# EAGLE design v12 (EAGLE 7.2.0)
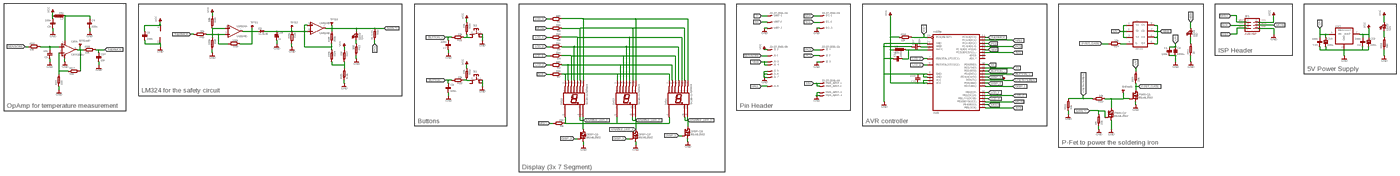
[diagram p0: schematic, sheet 1, overview]
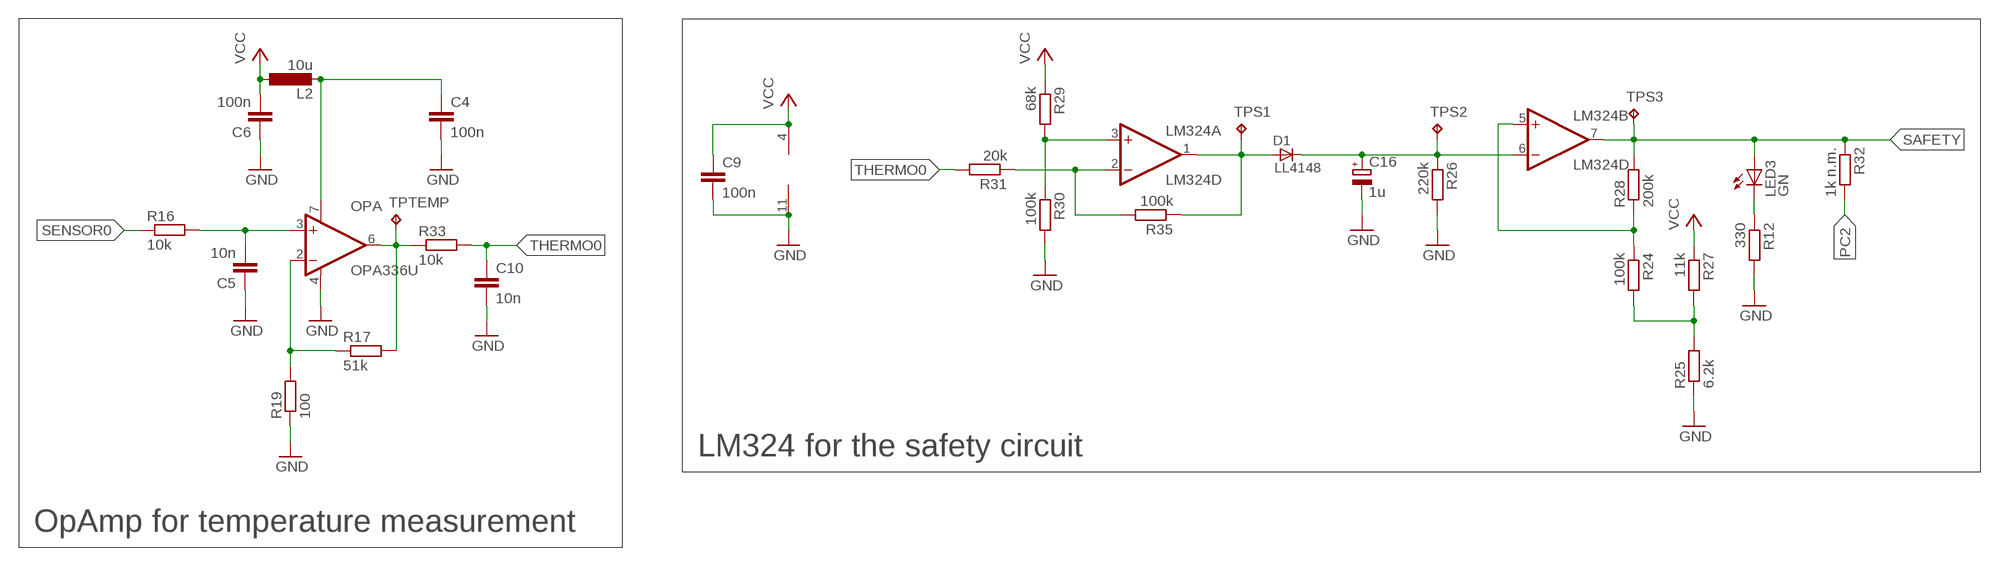
[diagram p1: schematic, sheet 1, part 1 of 4]
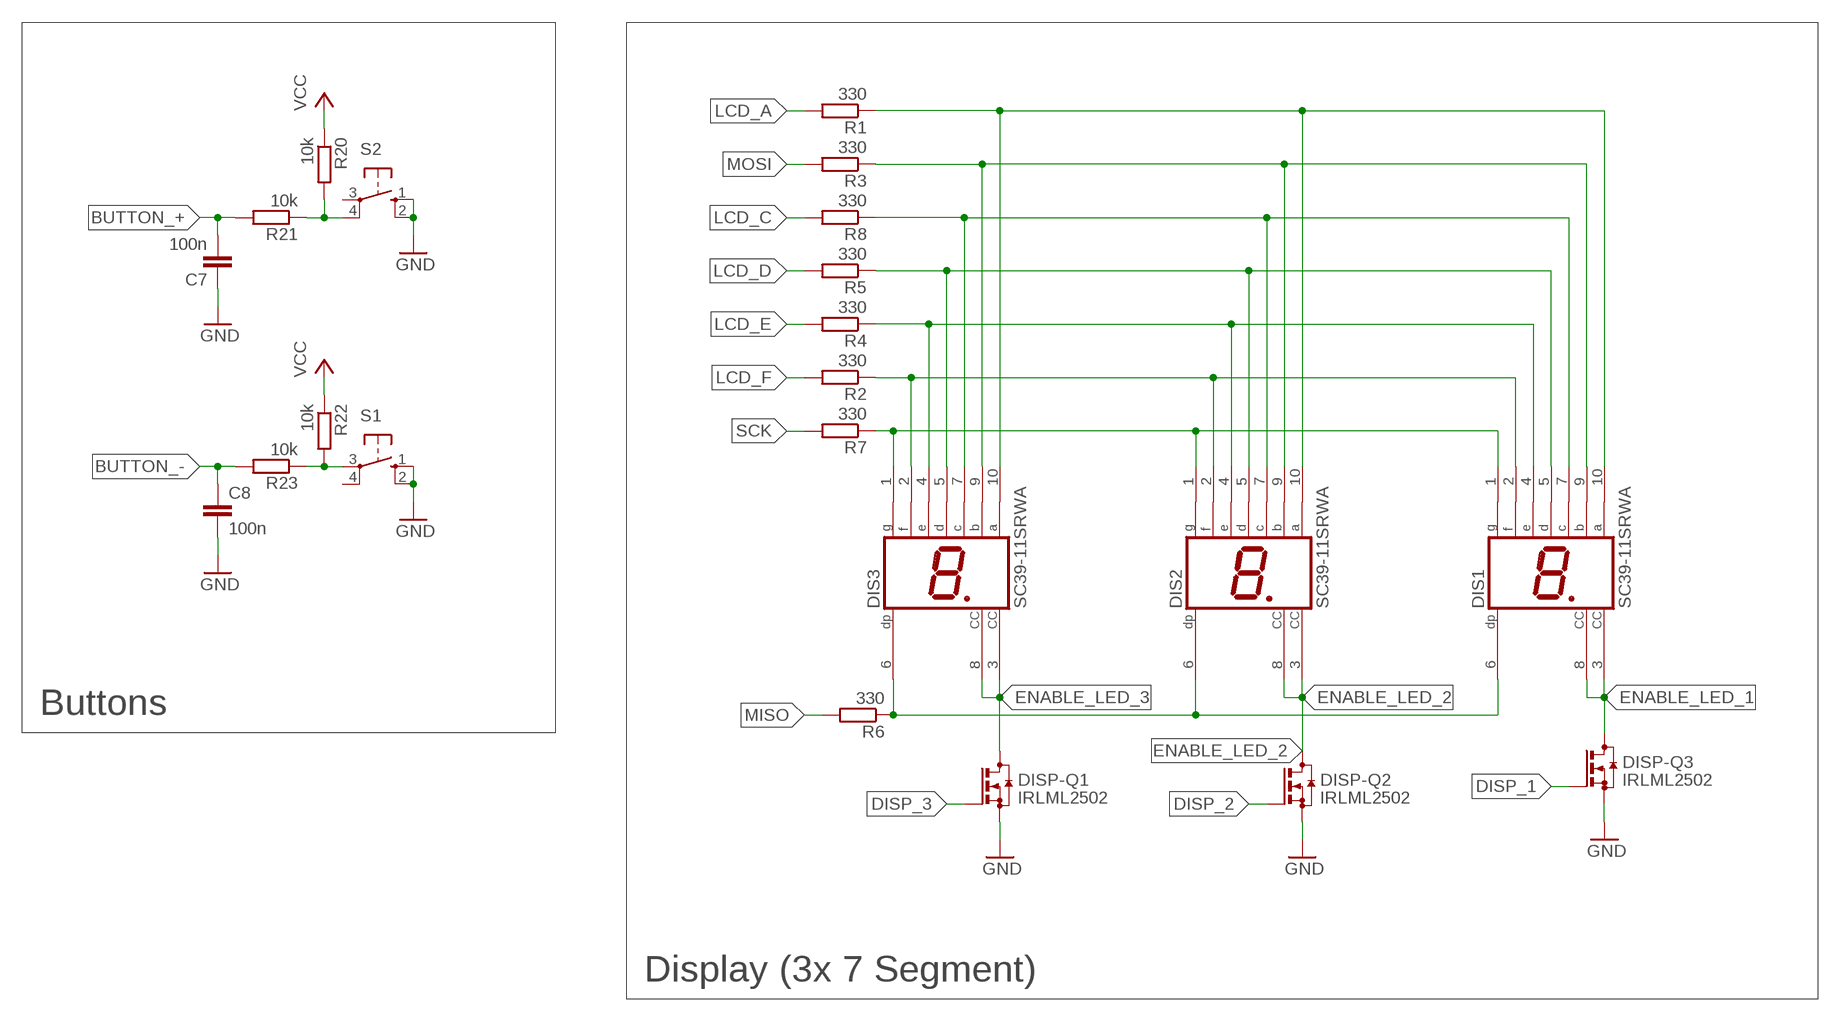
[diagram p2: schematic, sheet 1, part 2 of 4]
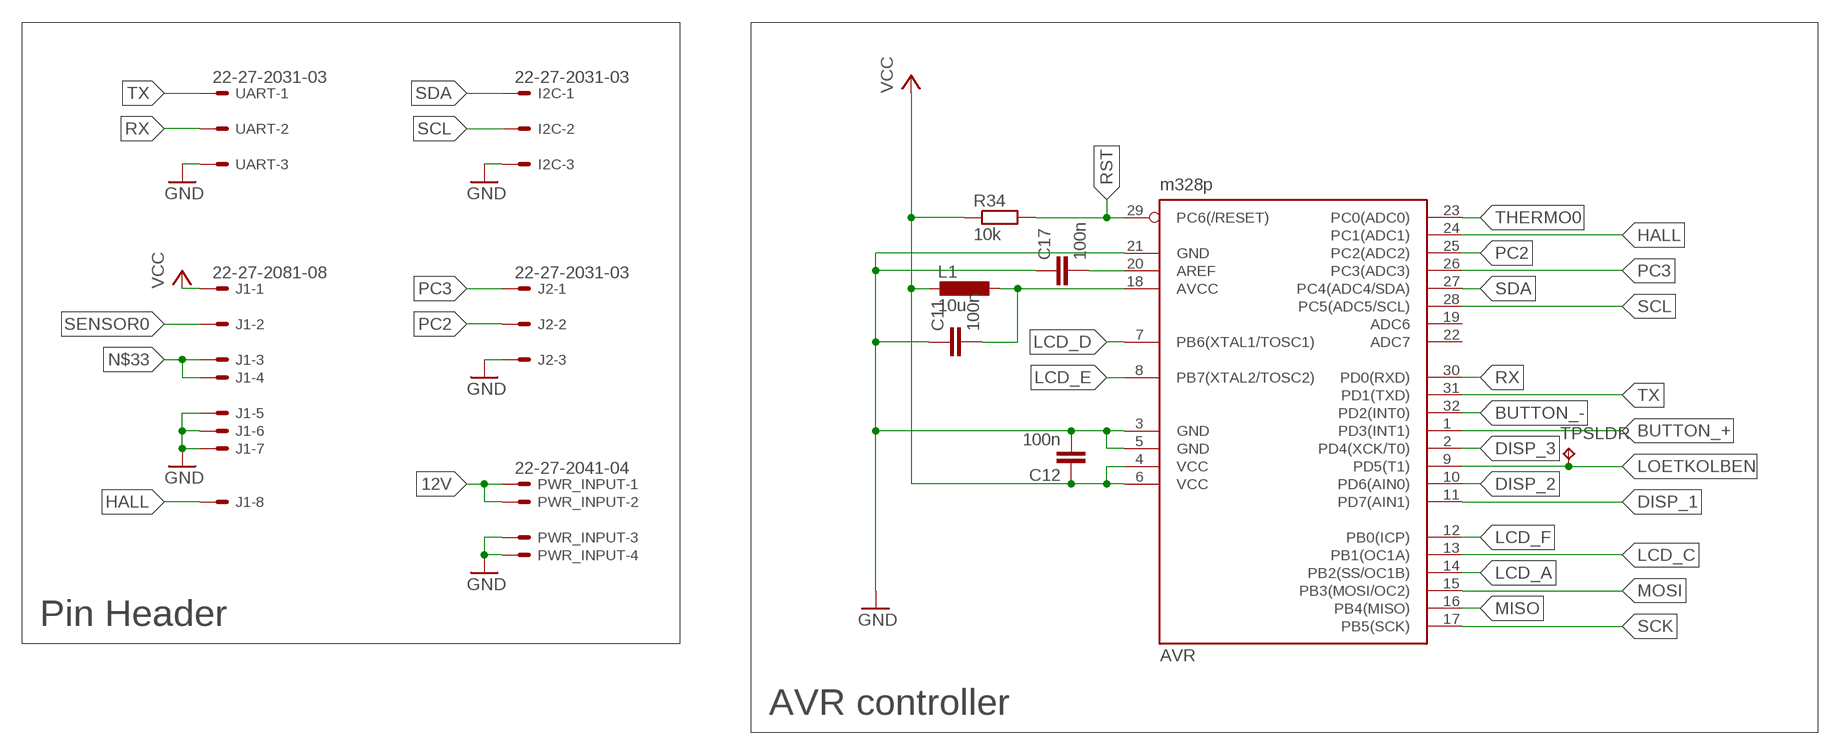
[diagram p3: schematic, sheet 1, part 3 of 4]
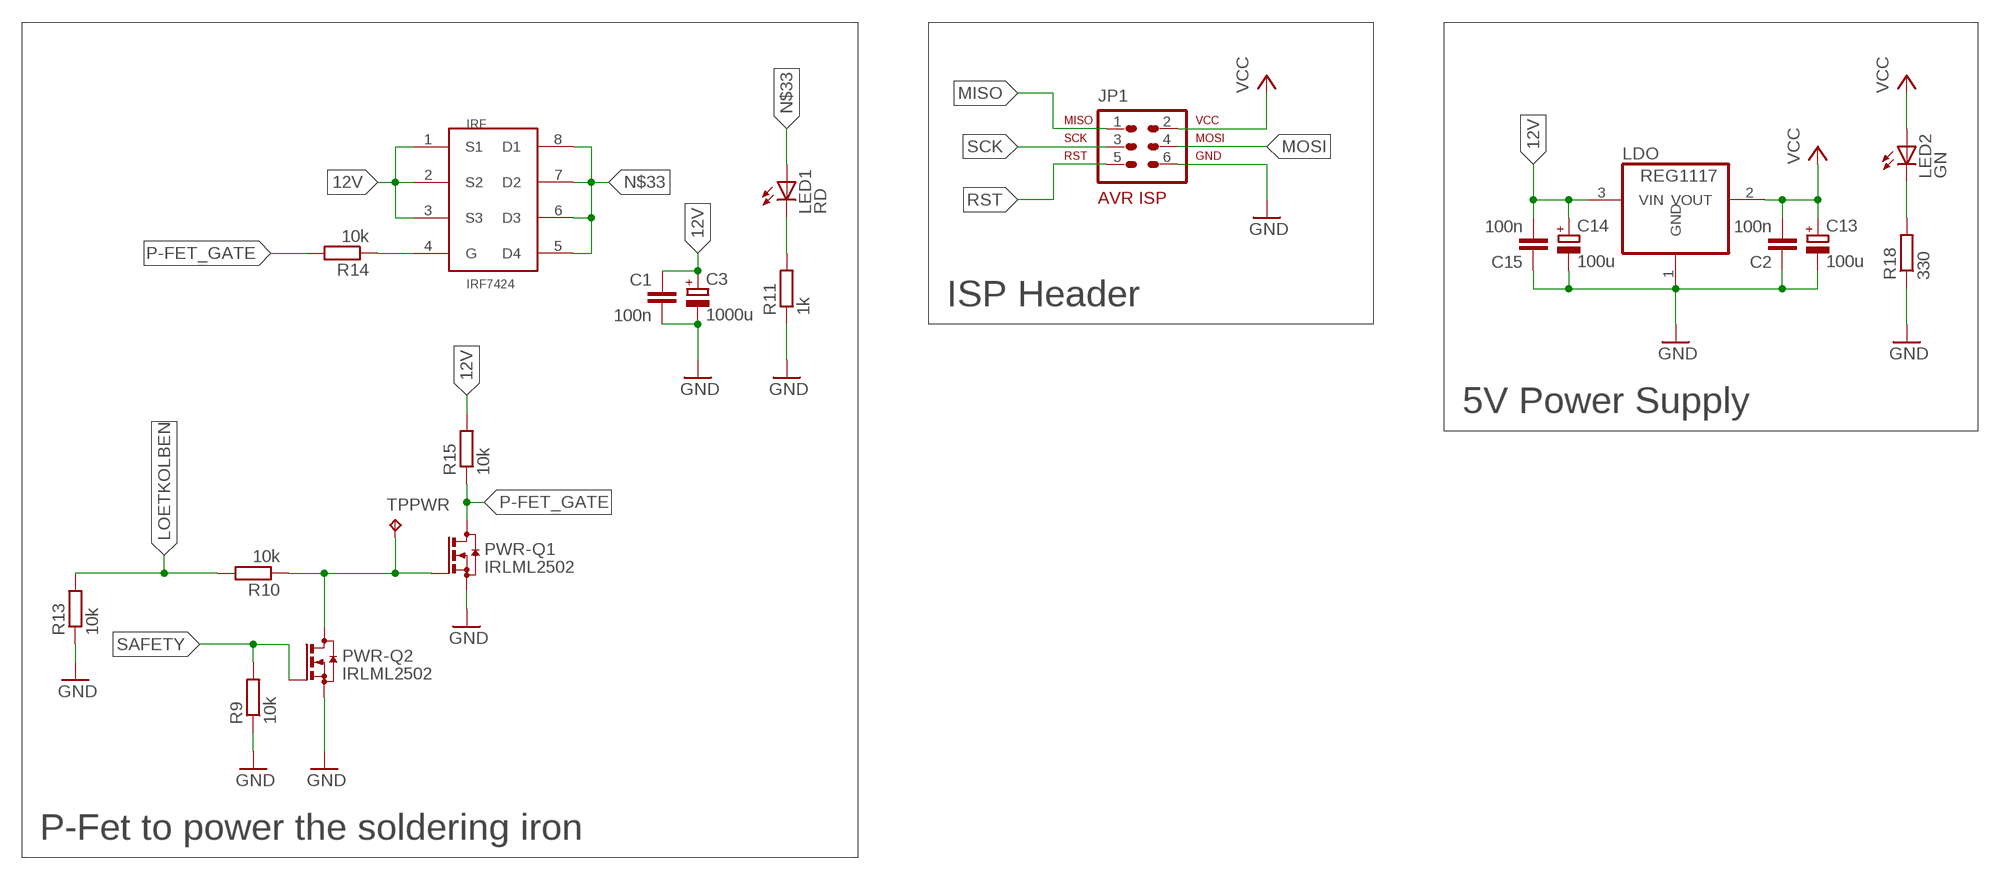
[diagram p4: schematic, sheet 1, part 4 of 4]

## Parts
AVR  m328p  MEGA8-AI  [TQFP32-08]
C1  100n  C-EUC0603  [C0603]
C2  100n  C-EUC0603  [C0603]
C3  1000u  CPOL-EUE5-13  [E5-13]
C4  100n  C-EUC0603  [C0603]
C5  10n  C-EUC0603  [C0603]
C6  100n  C-EUC0603  [C0603]
C7  100n  C-EUC0603  [C0603]
C8  100n  C-EUC0603  [C0603]
C9  100n  C-EUC0603  [C0603]
C10  10n  C-EUC0603  [C0603]
C11  100n  C-EUC0603  [C0603]
C12  100n  C-EUC0603  [C0603]
C13  100u  CPOL-EUE2-5  [E2-5]
C14  100u  CPOL-EUE2-5  [E2-5]
C15  100n  C-EUC0603  [C0603]
C16  1u  CPOL-EUE2-5  [E2-5]
C17  100n  C-EUC0603  [C0603]
D1  LL4148  [SOD80_DO213AA_MINIMELF]
DIS1  SC39-11SRWA  [HDSP-E]
DIS2  SC39-11SRWA  [HDSP-E]
DIS3  SC39-11SRWA  [HDSP-E]
DISP-Q1  IRLML2502  BSS123  [SOT23]
DISP-Q2  IRLML2502  BSS123  [SOT23]
DISP-Q3  IRLML2502  BSS123  [SOT23]
I2C  22-27-2031-03  [6410-03]
IRF  IRF7424  [SO-08]
J1  22-27-2081-08  [6410-08]
J2  22-27-2031-03  [6410-03]
JP1  AVR-ISP-6VERT  [AVR-ISP-6]
L1  10u  L-EUL2825P  [L2825P]
L2  10u  L-EUL2825P  [L2825P]
LDO  REG1117  [SOT223]
LED1  RD  LEDCHIP-LED0805  [CHIP-LED0805]
LED2  GN  LEDCHIP-LED0805  [CHIP-LED0805]
LED3  GN  LEDCHIP-LED0805  [CHIP-LED0805]
LM324  LM324D  [SO14]
OPA  OPA336U  [SO08]
PWR-Q1  IRLML2502  BSS123  [SOT23]
PWR-Q2  IRLML2502  BSS123  [SOT23]
PWR_INPUT  22-27-2041-04  [6410-04]
R1  330  R-EU_R0603  [R0603]
R2  330  R-EU_R0603  [R0603]
R3  330  R-EU_R0603  [R0603]
R4  330  R-EU_R0603  [R0603]
R5  330  R-EU_R0603  [R0603]
R6  330  R-EU_R0603  [R0603]
R7  330  R-EU_R0603  [R0603]
R8  330  R-EU_R0603  [R0603]
R9  10k  R-EU_R0603  [R0603]
R10  10k  R-EU_R0603  [R0603]
R11  1k  R-EU_R0603  [R0603]
R12  330  R-EU_R0603  [R0603]
R13  10k  R-EU_R0603  [R0603]
R14  10k  R-EU_R0603  [R0603]
R15  10k  R-EU_R0603  [R0603]
R16  10k  R-EU_R0603  [R0603]
R17  51k  R-EU_R0603  [R0603]
R18  330  R-EU_R0603  [R0603]
R19  100  R-EU_R0603  [R0603]
R20  10k  R-EU_R0603  [R0603]
R21  10k  R-EU_R0603  [R0603]
R22  10k  R-EU_R0603  [R0603]
R23  10k  R-EU_R0603  [R0603]
R24  100k  R-EU_R0603  [R0603]
R25  6.2k  R-EU_R0603  [R0603]
R26  220k  R-EU_R0603  [R0603]
R27  11k  R-EU_R0603  [R0603]
R28  200k  R-EU_R0603  [R0603]
R29  68k  R-EU_R0603  [R0603]
R30  100k  R-EU_R0603  [R0603]
R31  20k  R-EU_R0603  [R0603]
R32  1k n.m.  R-EU_R0603  [R0603]
R33  10k  R-EU_R0603  [R0603]
R34  10k  R-EU_R0603  [R0603]
R35  100k  R-EU_R0603  [R0603]
S1  10-XX  [B3F-10XX]
S2  10-XX  [B3F-10XX]
TPPWR  TPB1,27  [B1,27]
TPS1  TPB1,27  [B1,27]
TPS2  TPB1,27  [B1,27]
TPS3  TPB1,27  [B1,27]
TPSLDR  TPB1,27  [B1,27]
TPTEMP  TPB1,27  [B1,27]
UART  22-27-2031-03  [6410-03]

## Nets
12V: C1.1 C3.+ C14.+ C15.2 IRF.1(S1) IRF.2(S2) IRF.3(S3) LDO.3(VIN) PWR_INPUT.1 PWR_INPUT.2 R15.2
AREF: AVR.20(AREF) C17.2
AVCC: AVR.18(AVCC) C11.2 L1.1
BUTTON_+: AVR.1(PD3(INT1)) C7.2 R21.2
BUTTON_-: AVR.32(PD2(INT0)) C8.1 R23.2
DISP_1: AVR.11(PD7(AIN1)) DISP-Q3.1(G)
DISP_2: AVR.10(PD6(AIN0)) DISP-Q2.1(G)
DISP_3: AVR.2(PD4(XCK/T0)) DISP-Q1.1(G)
ENABLE_LED_1: DIS1.3(CC) DIS1.8(CC) DISP-Q3.3(D)
ENABLE_LED_2: DIS2.3(CC) DIS2.8(CC) DISP-Q2.3(D)
ENABLE_LED_3: DIS3.3(CC) DIS3.8(CC) DISP-Q1.3(D)
GND: AVR.3(GND) AVR.5(GND) AVR.21(GND) C1.2 C2.1 C3.- C4.2 C5.1 C6.1 C7.1 C8.2 C9.2 C10.2 C11.1 C12.2 C13.- C14.- C15.1 C16.- C17.1 DISP-Q1.2(S) DISP-Q2.2(S) DISP-Q3.2(S) I2C.3 J1.5 J1.6 J1.7 J2.3 JP1.6 LDO.1(GND) LM324.11(P:V-) OPA.4(V-) PWR-Q1.2(S) PWR-Q2.2(S) PWR_INPUT.3 PWR_INPUT.4 R9.1 R11.1 R12.2 R13.1 R18.1 R19.1 R25.1 R26.2 R30.2 S1.1(S) S1.2(S1) S2.1(S) S2.2(S1) UART.3
HALL: AVR.24(PC1(ADC1)) J1.8
LCD_A: AVR.14(PB2(SS/OC1B)) R1.2
LCD_C: AVR.13(PB1(OC1A)) R8.2
LCD_D: AVR.7(PB6(XTAL1/TOSC1)) R5.2
LCD_E: AVR.8(PB7(XTAL2/TOSC2)) R4.2
LCD_F: AVR.12(PB0(ICP)) R2.2
LOETKOLBEN: AVR.9(PD5(T1)) R10.2 R13.2 TPSLDR.TP
MISO: AVR.16(PB4(MISO)) JP1.1 R6.2
MOSI: AVR.15(PB3(MOSI/OC2)) JP1.4 R3.2
N$1: OPA.2(-IN) R17.1 R19.2
N$2: LED3.C R12.1
N$5: C4.1 L2.2 OPA.7(V+)
N$6: LM324.2(A:-IN) R31.1 R35.2
N$7: D1.A LM324.1(A:OUT) R35.1 TPS1.TP
N$8: LM324.3(A:+IN) R29.2 R30.1
N$11: C16.+ D1.C LM324.6(B:-IN) R26.1 TPS2.TP
N$12: LM324.5(B:+IN) R24.1 R28.1
N$14: R24.2 R25.2 R27.2
N$15: IRF.4(G) R14.1
N$16: PWR-Q1.1(G) PWR-Q2.3(D) R10.1 TPPWR.TP
N$22: R22.2 R23.1 S1.3(P)
N$23: R20.2 R21.1 S2.4(P1)
N$24: LED2.C R18.2
N$25: LED1.C R11.2
N$27: C5.2 OPA.3(+IN) R16.2
N$31: DIS1.6(DP) DIS2.6(DP) DIS3.6(DP) R6.1
N$33: IRF.5(D4) IRF.6(D3) IRF.7(D2) IRF.8(D1) J1.3 J1.4 LED1.A
N$34: DIS1.2(F) DIS2.2(F) DIS3.2(F) R2.1
N$35: DIS1.1(G) DIS2.1(G) DIS3.1(G) R7.1
N$36: DIS1.4(E) DIS2.4(E) DIS3.4(E) R4.1
N$37: DIS1.5(D) DIS2.5(D) DIS3.5(D) R5.1
N$38: DIS1.7(C) DIS2.7(C) DIS3.7(C) R8.1
N$39: DIS1.9(B) DIS2.9(B) DIS3.9(B) R3.1
N$40: DIS1.10(A) DIS2.10(A) DIS3.10(A) R1.1
OPA_OUT: OPA.6(OUT) R17.2 R33.1 TPTEMP.TP
P-FET_GATE: PWR-Q1.3(D) R14.2 R15.1
PC2: AVR.25(PC2(ADC2)) J2.2 R32.2
PC3: AVR.26(PC3(ADC3)) J2.1
RST: AVR.29(PC6(/RESET)) JP1.5 R34.2
RX: AVR.30(PD0(RXD)) UART.2
SAFETY: LED3.A LM324.7(B:OUT) PWR-Q2.1(G) R9.2 R28.2 R32.1 TPS3.TP
SCK: AVR.17(PB5(SCK)) JP1.3 R7.2
SCL: AVR.28(PC5(ADC5/SCL)) I2C.2
SDA: AVR.27(PC4(ADC4/SDA)) I2C.1
SENSOR0: J1.2 R16.1
THERMO0: AVR.23(PC0(ADC0)) C10.1 R31.2 R33.2
TX: AVR.31(PD1(TXD)) UART.1
VCC: AVR.4(VCC) AVR.6(VCC) C2.2 C6.2 C9.1 C12.1 C13.+ J1.1 JP1.2 L1.2 L2.1 LDO.2(VOUT) LED2.A LM324.4(P:V+) R20.1 R22.1 R27.1 R29.1 R34.1
Unconnected: AVR.19(ADC6) AVR.22(ADC7) LM324.8(C:OUT) LM324.9(C:-IN) LM324.10(C:+IN) LM324.12(D:+IN) LM324.13(D:-IN) LM324.14(D:OUT) S1.4(P1) S2.3(P)

## Notes on the sheet
- ISP Header
- 5V Power Supply
- LM324 for the safety circuit
- OpAmp for temperature measurement | Pin Header
- Buttons | AVR controller
- P-Fet to power the soldering iron
- Display (3x 7 Segment)

## Library data of the parts
AVR = atmel:MEGA8: MICROCONTROLLER 8 Kbytes FLASH, 1 kbytes SRAM, 512 bytes EEPROM, USART, 6-channel 10 bit ADC, 2-channel 8 bit ADC Pin compatible with Atmega48, ATMega88, ATMega168 Source: avr.lbr; MPN: ATMEGA8-16AU; OC_FARNELL: 9171371; OC_NEWARK: 73M8863
C1 C2 C4-C12 C15 C17 = rcl:C-EU: CAPACITOR, European symbol
C3 C13 C14 C16 = rcl:CPOL-EU: POLARIZED CAPACITOR, European symbol
D1 = _hhn_diodes_smd:LL4148: 1N4148 General Purpose Rectifie SMD-Version of 1N4148 Case: SOD 80 = DO 213 AA = MINIMELF (Glass) Author: Dipl.-Ing. FH Rainer Bayer HHN Hochschule Heilbronn, rainer.bayer@hs-heilbronn.de Ingenieurbüro ing-rb, mail@ing-rb.de
DIS1-DIS3 = display-hp:SC39-11SRWA: SINGLE DIGIT NUMERIC DISPLAY 9.9mm (0.39INCH) Source: SC39-11SRWA.pdf; OC_FARNELL: unknown; OC_NEWARK: unknown
DISP-Q1-DISP-Q3 PWR-Q1 PWR-Q2 = transistor-small-signal:BSS123: N-CHANNEL MOS FET
I2C J2 UART = con-molex:22-?-03: CONNECTOR wire to board 2.54 mm (.1 inch) pitch header; OC_FARNELL: unknown; OC_NEWARK: unknown
IRF = MyLib:IRF7424
J1 = con-molex:22-?-08: CONNECTOR wire to board 2.54 mm (.1 inch) pitch header; OC_FARNELL: unknown; OC_NEWARK: unknown
JP1 = avr-7:AVR-ISP-6: AVR ISP-6 Serial Programming Header
L1 L2 = rcl:L-EU: INDUCTOR, European symbol
LDO = burr-brown:REG1117: 800mA and 1A Low Dropout (LDO) Positive Regulator 1.8V, 2.5V, 2.85V, 3.3V, 5V, and Adj; MPN: REG1117; OC_FARNELL: 1097566; OC_NEWARK: 14P6981
LED1-LED3 = led:LED: LED OSRAM: - CHIPLED LG R971, LG N971, LY N971, LG Q971, LY Q971, LO R971, LY R971 LH N974, LH R974 LS Q976, LO Q976, LY Q976 LO Q996 - Hyper CHIPLED LW Q18S LB Q993, LB Q99A, LB R99A - SideLED LS A670, LO A670, LY A670, LG A670, LP A670 LB A673, LV A673, LT A673, LW A673 LH A674 LY A675 LS A676, LA A676, LO A676, LY A676, LW A676 LS A679, LY A679, LG A679 - Hyper Micro SIDELED® LS Y876, LA Y876, LO Y876, LY Y876 LT Y87S - SmartLED LW L88C, LW L88S LB L89C, LB L89S, LG L890 LS L89K, LO L89K, LY L89K LS L896, LA L896, LO L896, LY L896 - TOPLED LS T670, LO T670, LY T670, LG T670, LP T670 LSG T670, LSP T670, LSY T670, LOP T670, LYG T670 LG T671, LOG T671, LSG T671 LB T673, LV T673, LT T673, LW T673 LH T674 LS T676, LA T676, LO T676, LY T676, LB T676, LH T676, LSB T676, LW T676 LB T67C, LV T67C, LT T67C, LS T67K, LO T67K, LY T67K, LW E67C LS E67B, LA E67B, LO E67B, LY E67B, LB E67C, LV E67C, LT E67C LW T67C LS T679, LY T679, LG T679 LS T770, LO T770, LY T770, LG T770, LP T770 LB T773, LV T773, LT T773, LW T773 LH T774 LS E675, LA E675, LY E675, LS T675 LS T776, LA T776, LO T776, LY T776, LB T776 LHGB T686 LT T68C, LB T68C - Hyper Mini TOPLED® LB M676 - Mini TOPLED Santana® LG M470 LS M47K, LO M47K, LY M47K Source: http://www.osram.convergy.de LUXEON: - LUMILED® LXK2-PW12-R00, LXK2-PW12-S00, LXK2-PW14-U00, LXK2-PW14-V00 LXK2-PM12-R00, LXK2-PM12-S00, LXK2-PM14-U00 LXK2-PE12-Q00, LXK2-PE12-R00, LXK2-PE12-S00, LXK2-PE14-T00, LXK2-PE14-U00 LXK2-PB12-K00, LXK2-PB12-L00, LXK2-PB12-M00, LXK2-PB14-N00, LXK2-PB14-P00, LXK2-PB14-Q00 LXK2-PR12-L00, LXK2-PR12-M00, LXK2-PR14-Q00, LXK2-PR14-R00 LXK2-PD12-Q00, LXK2-PD12-R00, LXK2-PD12-S00 LXK2-PH12-R00, LXK2-PH12-S00 LXK2-PL12-P00, LXK2-PL12-Q00, LXK2-PL12-R00 Source: www.luxeon.com KINGBRIGHT: KA-3528ASYC Source: www.kingbright.com
LM324 = linear:LM324: OP AMP
OPA = burr-brown:OPA336: CMOS Operational Amplifiers Single-Supply, MicroPower, MicroAmplifier(TM) Series; MF: TEXAS INSTRUMENT CONNECTORS; MPN: OPA336UA; OC_FARNELL: 1459587; OC_NEWARK: 35C1888
PWR_INPUT = con-molex:22-?-04: CONNECTOR wire to board 2.54 mm (.1 inch) pitch header; OC_FARNELL: unknown; OC_NEWARK: unknown
R1-R35 = rcl:R-EU_: RESISTOR, European symbol
S1 S2 = switch-omron:10-XX: OMRON SWITCH; MPN: B3F-1000; OC_FARNELL: 176432; OC_NEWARK: 36M3542
TPPWR TPS1-TPS3 TPSLDR TPTEMP = testpad:TP: Test pad

## Board
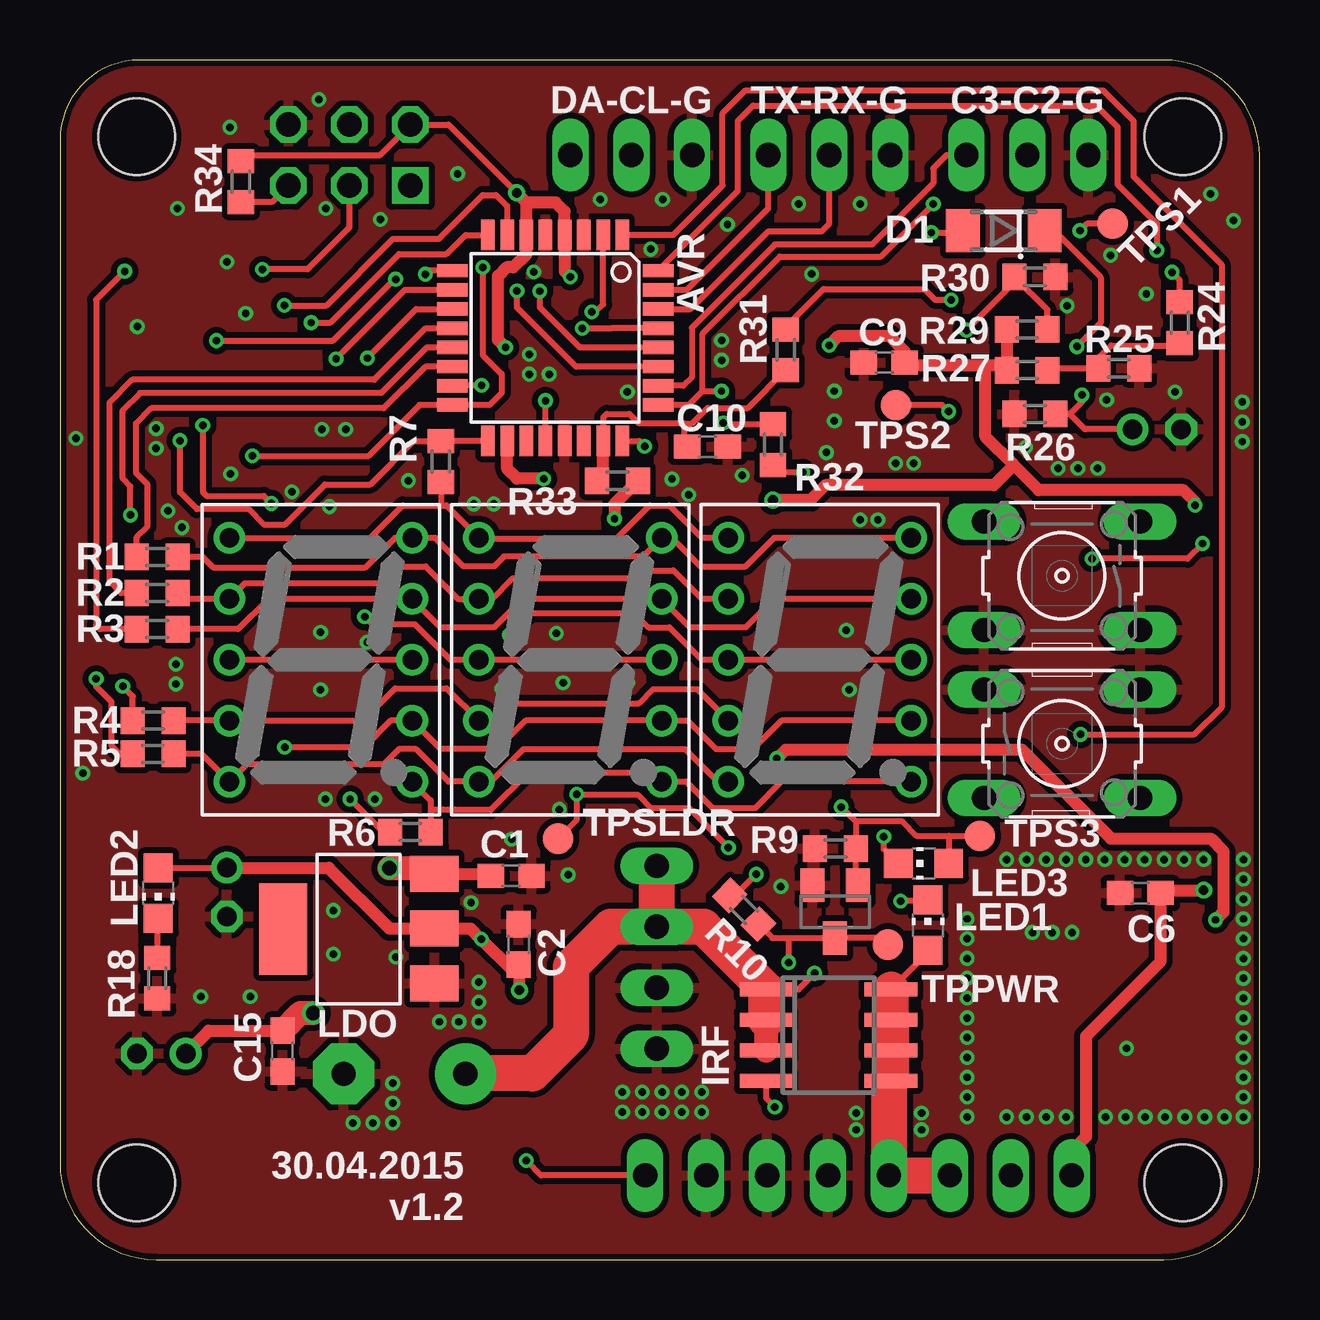
[diagram p5: board, top side]
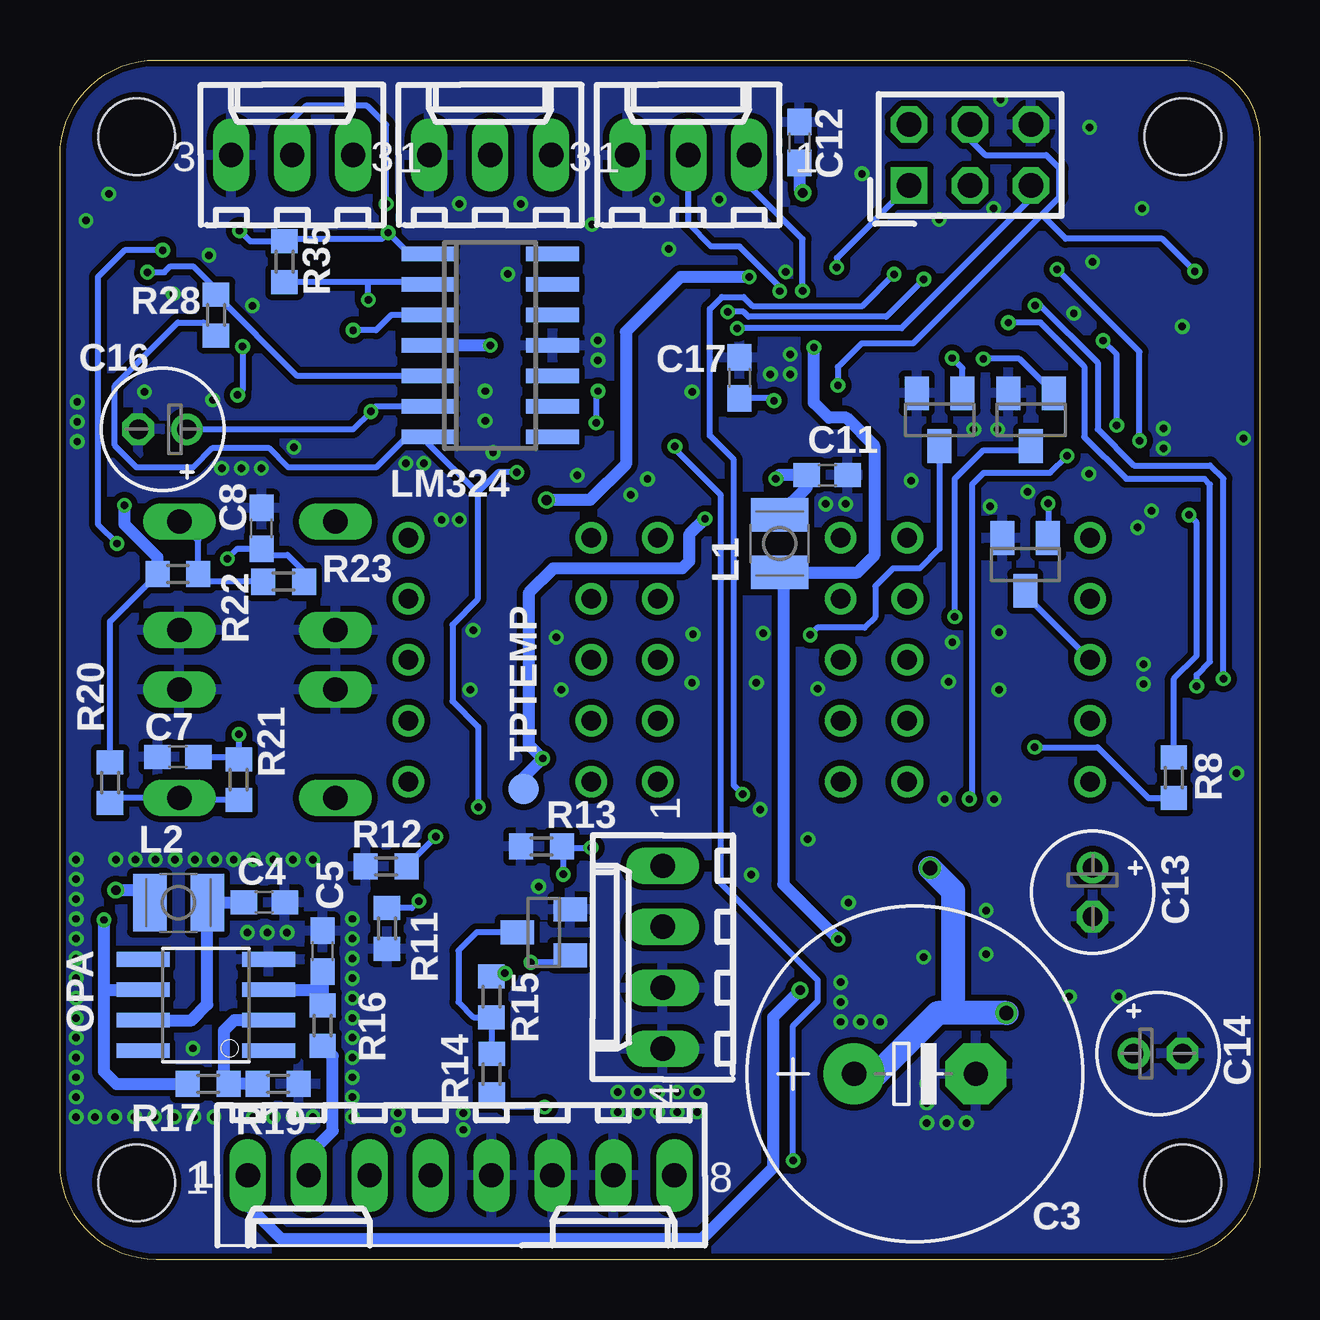
[diagram p6: board, bottom side, seen from below]

Size 50 x 50 mm. Coordinates in mm from the lower left corner, seen from the top.
Outline: 4,0 46,0 arc90 50,4 50,46 arc90 46,50 3.33,50 arc90 0,46.67 0,4 arc90 4,0
Copper layers (1*16): Top 0.035mm / dielectric 1.5mm / Bottom 0.035mm
Design rules "ITEADstudio_DRC *": minimum track width 6mil, minimum drill 12mil, track to track 6mil, track to pad 6mil, pad to pad 6mil, via to via 6mil, smd to smd 0mil, copper to edge 10mil, drill to drill 10mil, minimum pad ring 10mil, minimum via ring 6mil, stop-mask expansion 2mil, vias tented up to drill 100mil, thermal gap 10mil
Holes 3.2 mm at 46.8,46.8 3.2,46.8 46.8,3.2 3.2,3.2

### Footprints (pad centres in the part's own frame; a part is rotated, then mirrored left to right if it is on the bottom)
TQFP32-08 = smd 1.27 x 0.559: 1 -4.293,2.8; 2 -4.293,2; 3 -4.293,1.2; 4 -4.293,0.4; 5 -4.293,-0.4; 6 -4.293,-1.2; 7 -4.293,-2; 8 -4.293,-2.8; 17 4.293,-2.8; 18 4.293,-2; 19 4.293,-1.2; 20 4.293,-0.4; 21 4.293,0.4; 22 4.293,1.2; 23 4.293,2; 24 4.293,2.8 | smd 0.559 x 1.27: 9 -2.8,-4.293; 10 -2,-4.293; 11 -1.2,-4.293; 12 -0.4,-4.293; 13 0.4,-4.293; 14 1.2,-4.293; 15 2,-4.293; 16 2.8,-4.293; 25 2.8,4.293; 26 2,4.293; 27 1.2,4.293; 28 0.4,4.293; 29 -0.4,4.293; 30 -1.2,4.293; 31 -2,4.293; 32 -2.8,4.293
C0603 = smd 1.1 x 1: 1 -0.85,0; 2 0.85,0
E5-13 = drill 1.016 pad 2.54: + -2.54,0 | drill 1.016 pad 2.54 octagon: - 2.54,0
E2-5 = drill 0.813 pad 1.27: + -1.016,0 | drill 0.813 pad 1.27 octagon: - 1.016,0
SOD80_DO213AA_MINIMELF = smd 1.4 x 1.8: A 1.7,0; C -1.7,0
HDSP-E = drill 0.813: 1 -3.81,5.08; 2 -3.81,2.54; 3 -3.81,0; 4 -3.81,-2.54; 5 -3.81,-5.08; 6 3.81,-5.08; 7 3.81,-2.54; 8 3.81,0; 9 3.81,2.54; 10 3.81,5.08
SOT23 = smd 1 x 1.4: 1 -0.95,-1.1; 2 0.95,-1.1; 3 0,1.1
6410-03 = drill 1.016 long: 1 2.54,0; 2 0,0; 3 -2.54,0
SO-08 = smd 0.6 x 2.2: 1 -1.905,-2.6; 2 -0.635,-2.6; 3 0.635,-2.6; 4 1.905,-2.6; 5 1.905,2.6; 6 0.635,2.6; 7 -0.635,2.6; 8 -1.905,2.6
6410-08 = drill 1.016 long: 1 8.89,0; 2 6.35,0; 3 3.81,0; 4 1.27,0; 5 -1.27,0; 6 -3.81,0; 7 -6.35,0; 8 -8.89,0
AVR-ISP-6 = drill 1.016 square: 1 -2.54,-1.27 | drill 1.016 octagon: 2 -2.54,1.27; 3 0,-1.27; 4 0,1.27; 5 2.54,-1.27; 6 2.54,1.27
L2825P = smd 1.4 x 2.4: 1 -1.2,0; 2 1.2,0
SOT223 = smd 1.499 x 2.007: 1 -2.261,-3.15; 2 0.025,-3.15; 3 2.311,-3.15 | smd 3.81 x 2.007: 4 0,3.15
CHIP-LED0805 = smd 1.2 x 1.2: A 0,-1.05; C 0,1.05
SO14 = smd 0.6 x 2.2: 1 -3.81,-2.6; 2 -2.54,-2.6; 3 -1.27,-2.6; 4 0,-2.6; 5 1.27,-2.6; 6 2.54,-2.6; 7 3.81,-2.6; 8 3.81,2.6; 9 2.54,2.6; 10 1.27,2.6; 11 0,2.6; 12 -1.27,2.6; 13 -2.54,2.6; 14 -3.81,2.6
SO08 = smd 0.61 x 2.21: 1 -1.905,-2.616; 2 -0.635,-2.616; 3 0.635,-2.616; 4 1.905,-2.616; 5 1.905,2.616; 6 0.635,2.616; 7 -0.635,2.616; 8 -1.905,2.616
6410-04 = drill 1.016 long: 1 3.81,0; 2 1.27,0; 3 -1.27,0; 4 -3.81,0
R0603 = smd 1 x 1.1: 1 -0.85,0; 2 0.85,0
B3F-10XX = drill 1.016 long: 1 -3.251,2.261; 2 3.251,2.261; 3 -3.251,-2.261; 4 3.251,-2.261
B1,27 = smd 1.27 x 1.27: TP 0,0

### Placement (x,y rotation side)
AVR  20.64,38.42 270 top
C1  18.81,15.99 0 top
C2  19.12,13.13 270 top
C3  14.36,7.74 0 bottom
C4  41.48,14.89 0 bottom
C5  39.06,12.86 270 bottom
C6  45.03,15.27 0 top
C7  45.09,20.95 0 bottom
C8  41.59,30.48 90 bottom
C9  34.36,37.39 180 top
C10  26.99,33.88 0 top
C11  18.02,32.7 180 bottom
C12  19.17,46.56 90 bottom
C13  6.96,15.31 270 bottom
C14  4.23,8.59 0 bottom
C15  9.28,8.69 90 top
C16  45.72,34.61 180 bottom
C17  21.67,36.75 270 bottom
D1  39.34,42.88 180 top
DIS1  31.67,25 0 top
DIS2  21.27,25 0 top
DIS3  10.87,25 0 top
DISP-Q1  9.76,28.97 180 bottom
DISP-Q2  9.53,35 180 bottom
DISP-Q3  13.34,35 180 bottom
I2C  23.81,46.04 0 bottom
IRF  32.04,9.35 270 top
J1  33.28,3.51 180 bottom
J2  40.32,46.04 0 bottom
JP1  12.06,46.04 0 bottom
L1  20,29.84 270 bottom
L2  45.06,14.87 0 bottom
LDO  12.46,13.77 90 top
LED1  36.18,13.94 0 top
LED2  4.1,15.27 180 top
LED3  35.99,16.51 90 top
LM324  32.07,38.1 270 bottom
OPA  43.92,10.61 90 bottom
PWR-Q1  29.83,13.64 90 bottom
PWR-Q2  32.31,14.5 180 top
PWR_INPUT  24.88,12.6 90 bottom
R1  4.05,29.29 180 top
R2  4.05,27.78 180 top
R3  4.05,26.27 180 top
R4  3.89,22.46 180 top
R5  3.88,21.08 180 top
R6  14.61,17.82 180 top
R7  15.88,33.26 90 top
R8  3.57,20.08 90 bottom
R9  32.32,17.13 0 top
R10  28.51,14.58 135 top
R11  36.37,13.8 90 bottom
R12  36.4,16.39 180 bottom
R13  29.93,17.22 0 bottom
R14  32,7.73 90 bottom
R15  32.01,10.95 90 bottom
R16  39.05,9.75 90 bottom
R17  43.82,7.32 180 bottom
R18  4.05,11.73 90 top
R19  40.91,7.32 180 bottom
R20  47.91,19.87 270 bottom
R21  42.55,20 90 bottom
R22  45.09,28.57 0 bottom
R23  40.67,28.26 0 bottom
R24  46.67,39.05 270 top
R25  44.13,37.15 180 top
R26  40.64,35.24 180 top
R27  40.31,37.06 0 top
R28  43.5,39.37 270 bottom
R29  40.31,38.76 0 top
R30  40.64,40.96 0 top
R31  30.25,37.92 270 top
R32  29.72,33.97 90 top
R33  23.24,32.46 180 top
R34  7.54,44.93 270 top
R35  40.64,41.59 270 bottom
S1  41.77,28.5 180 top
S2  41.77,21.5 0 top
TPPWR  34.51,13.13 0 top
TPS1  43.88,43.17 0 top
TPS2  34.84,35.62 0 top
TPS3  38.34,17.67 0 top
TPSLDR  20.76,17.54 0 top
TPTEMP  30.67,19.61 0 bottom
UART  32.07,46.04 0 bottom

### Tracks (layer width: path | path; a pad name or v marks a point on that pad's centre or on a via)
12V  (via drill 0.31, 0.6)
  Top 0.254: v31.45,11.93 30.78,11.26 IRF.1 | 17.87,16.08 C1.1
  Top 0.5: 17.87,16.08 LDO.3 15.38,16.31 | C14.+ 6.2,9.54 C15.2
  Top 1: 15.38,16.31 v13.73,16.31 | C15.2 10.02,10.28 v10.55,10.28 | IRF.2 IRF.3
  Top 1.5: 29.43,11.27 IRF.1 | IRF.1 IRF.2 | IRF.1 26.83,13.87 PWR_INPUT.2 | PWR_INPUT.2 PWR_INPUT.1 | PWR_INPUT.2 22.95,13.87 21.3,12.22 21.3,9.37 19.69,7.76 16.92,7.76 C3.+
  Bottom 0.254: v31.45,11.93 31.89,11.93 R15.2
  Bottom 0.5: 12.77,10.91 13.41,10.28
  Bottom 1: v13.73,16.31 12.77,15.36 12.77,10.91 | v10.55,10.28 13.41,10.28 15.95,7.74 C3.+
AREF  (via drill 0.31)
  Top 0.254: AVR.20 v20.24,35.8
  Bottom 0.254: v20.24,35.8 20.34,35.9 C17.2
AVCC  (via drill 0.31)
  Top 0.5: v20.16,32.54 19.05,32.54 18.64,32.96 AVR.18
  Bottom 0.254: C11.2 18.87,32.18
  Bottom 0.5: 18.87,32.18 L1.1 | C11.2 20,32.7 v20.16,32.54
BUTTON_+  (via drill 0.31)
  Top 0.254: AVR.1 25.57,42.71 27.62,44.77 27.62,47.78 28.57,48.74 43.47,48.74 44.74,47.47 44.74,45.16 48.42,41.48 48.42,23.02 47.29,21.89 v42.55,21.89
  Bottom 0.254: C7.2 42.65,20.95 R21.2 v42.55,21.89
BUTTON_-  (via drill 0.31)
  Top 0.254: AVR.32 28.26,44.55 28.26,47.47 28.89,48.1 43.2,48.1 44.08,47.22 44.08,44.83 45.72,43.19 v45.72,42.07 | v47.62,29.84 46.99,29.21 v43.02,29.21
  Bottom 0.254: R23.2 39.83,28.68 40.52,29.37 41.33,29.37 C8.1 42.6,29.63 v43.02,29.21 | v45.72,42.07 47.31,42.07 48.42,40.96 48.42,30.64 v47.62,29.84
DISP_1  (via drill 0.31)
  Top 0.254: v12.81,37.57 14.85,39.62 AVR.11
  Bottom 0.254: DISP-Q3.1 12.38,37.15 v12.81,37.57
DISP_2  (via drill 0.31)
  Top 0.254: v11.51,37.54 14.38,40.42 AVR.10
  Bottom 0.254: DISP-Q2.1 10.02,37.54 v11.51,37.54
DISP_3  (via drill 0.31)
  Top 0.254: v5.95,34.77 5.95,31.99 6.11,31.83 8.49,31.83 v8.81,31.51 | v6.52,38.3 11.39,38.3 13.95,40.86 v13.99,40.86 | AVR.2 22.64,39.81 22.33,39.5 v22.16,39.5
  Bottom 0.254: v8.81,31.51 DISP-Q1.1 | v5.95,34.77 5.95,37.73 v6.52,38.3 | v13.99,40.86 15.56,39.29 21.3,39.29 21.5,39.5 v22.16,39.5
ENABLE_LED_1  (via drill 0.31)
  Top 0.254: DIS1.8 DIS1.3 26.75,25 25.4,26.35 24.54,26.35 23.94,26.95 19.65,26.95 v18.73,26.04
  Bottom 0.254: DISP-Q3.3 13.34,29.63 14.16,28.81 15.27,28.81 16.02,28.07 16.02,26.79 16.47,26.33 18.43,26.33 v18.73,26.04
ENABLE_LED_2  (via drill 0.31)
  Top 0.254: DIS2.8 DIS2.3 16.27,25 14.8,26.48 13.02,26.48 v12.7,26.79
  Bottom 0.254: v12.7,26.79 12.7,32.54 11.51,33.73 9.7,33.73 DISP-Q2.3
ENABLE_LED_3
  Top 0.254: DIS3.8 DIS3.3
  Bottom 0.254: DISP-Q1.3 9.76,27.7 DIS3.3
GND  (via drill 0.31)
  other vias: 40.25,33.86 42.43,32.98 19.56,36.9 17.25,31.49 14.53,32.46 11.23,31.39 7.11,32.75 10.92,34.61 9.67,32 22.52,44.18 43.26,32.98 43.63,35.84 43.8,41.86 33.35,44.01 30.79,44.01 27.82,43.14 23.65,36.17 25.51,32.53 28.44,32.69 31.95,33.64 4.01,33.81 5.08,30.51 0.66,34.23 3.22,38.89 0.95,20.28 16.57,45.26 13.35,43.36 11.08,43.81 6.96,41.58 37.81,11.72 49.33,10.07 10.86,26.15 10.86,23.75 11.06,19.19 37.81,10.9 37.81,10.07 37.81,9.25 37.81,8.42 37.81,7.59 37.81,6.77 37.81,12.55 37.81,13.37 44.46,8.8 30.05,15.55 37.81,14.2 39.46,16.68 40.28,16.68 41.11,16.68 41.94,16.68 42.76,16.68 31.33,41.08 27.57,37.49 32.28,36.2 32.28,34.96 27.57,38.31 49.33,10.9 49.33,11.72 49.33,12.55 49.33,13.37 49.33,14.2 49.33,15.02 49.33,15.85 49.33,16.68 47.68,16.68 46.02,16.68 46.85,16.68 43.55,16.68 45.2,16.68 44.37,16.68 49.33,9.25 49.33,8.42 49.33,7.59 49.33,6.77 49.33,5.94 37.81,5.94 39.46,5.94 40.28,5.94 41.11,5.94 41.94,5.94 43.59,5.94 44.41,5.94 45.24,5.94 46.06,5.94 46.89,5.94 47.71,5.94 48.54,5.94 17.46,9.91 16.63,9.91 15.81,9.91 17.46,11.56 17.46,10.73 40.54,13.63 41.36,13.63 42.19,13.63 23.44,6.98 24.27,6.98 25.1,6.98 25.92,6.98 26.75,6.98 23.44,6.15 24.27,6.15 25.1,6.15 25.92,6.15 26.75,6.15 33.19,5.41 35.91,5.41 33.19,6.11 35.91,6.11 26.21,31.87 18.83,17.52 21.18,16.03 11.4,14.55 11.4,12.73 20.97,24.04 18.41,23.79 23.66,24.04 25.12,44.18 10.79,48.35 7.08,47.2 4.89,43.81 13.87,5.7 13.04,5.7 12.22,5.7 13.87,7.35 13.87,6.52 11.91,34.61 20.39,36.9 19.56,37.73 7.74,39.44 47.96,44.42 48.91,43.31 45.28,40.25 17.14,14.88 14,12.61 7.93,10.96 5.87,10.96 4.5,31.21 4.01,34.64 4.83,24.82 4.83,23.99 34.09,30.83 34.84,33.19 41.98,39.76 46.48,36.17 49.28,35.74 49.28,34.92 49.28,34.09 41.61,32.98 35.58,33.19 18.08,31.49 29.11,23.75 32.9,23.75 29.31,25.94 32.78,26.23 20.69,26.1 23.62,26.06 12.8,25.73 12.97,24.08 33.35,30.83 24.62,42.12 19.75,41.17 20.81,18.76 13.13,19.19
  pour Top (isolate 0.25): 0,0 50.16,0 50.16,50.16 0,50.16
  pour Bottom (isolate 0.25): 0,0 49.85,0 49.85,49.85 0,49.85
HALL  (via drill 0.31)
  Top 0.254: AVR.24 24.14,34.12 v24.37,33.89 | v19.44,4.13 20.06,3.51 J1.8
  Bottom 0.254: v24.37,33.89 24.37,33.78 22.45,31.86 22.45,15.68 18.41,11.64 18.41,10.77 19.44,9.74 v19.44,4.13
LCD_A
  Top 0.254: AVR.14 15.23,37.22 13.49,35.48 3.81,35.48 3.17,34.85 3.17,32.78 3.65,32.31 3.65,30.56 3.2,30.11 R1.2
LCD_C  (via drill 0.31)
  Top 0.254: AVR.13 15.29,38.02 13.39,36.12 3.33,36.12 2.62,35.4 2.62,32.54 2.94,32.23 v2.94,31.04
  Bottom 0.254: R8.2 3.57,24.21 2.62,25.16 2.62,30.72 v2.94,31.04
LCD_D  (via drill 0.31)
  Top 0.254: v1.51,24.21 1.51,23.89 2.14,23.26 2.14,21.43 2.49,21.08 R5.2 | v9.35,39.77 11.11,39.77 13.89,42.55 15.79,42.55 16.46,43.22 16.47,43.22 17.62,44.37 18.18,44.37 18.64,43.91 AVR.7
  Bottom 0.254: v1.51,24.21 1.51,32.54 2.06,33.1 5.24,33.1 6.75,34.61 6.75,37.39 9.13,39.77 v9.35,39.77
LCD_E  (via drill 0.31)
  Top 0.254: R4.2 3.04,23.47 v2.62,23.89 | v10.47,39.05 11.27,39.05 14.13,41.91 16.11,41.91 16.91,42.7 AVR.8
  Bottom 0.254: v2.62,23.89 2.62,24.37 2.06,24.92 2.06,32.31 2.3,32.54 5.56,32.54 7.3,34.29 7.3,37.22 9.13,39.05 v10.47,39.05
LCD_F
  Top 0.254: R2.2 2.54,27.78 2.06,28.26 2.06,35.72 3.02,36.67 13.1,36.67 15.24,38.82 AVR.12
LOETKOLBEN  (via drill 0.31)
  Top 0.254: v27.86,17.17 26.21,18.82 24.64,18.82 24.11,19.36 21.5,19.36 v21.55,19.4 21.55,18.33 TPSLDR.TP | v29.02,16.06 28.14,15.18 R10.2 | AVR.9 15.38,41.22 v15.23,41.07
  Bottom 0.254: v29.02,16.06 29.02,17.16 | 29.02,17.16 R13.2 | 29.02,17.16 27.87,17.16 v27.86,17.17 | v21.55,19.4 21.91,19.76 21.91,33.34 22.91,34.34 22.91,39.62 22.41,40.12 21.5,40.12 21.13,39.75 16.55,39.75 v15.23,41.07
MISO  (via drill 0.31)
  Top 0.254: v8.02,33.5 12.86,33.5 14.98,35.62 AVR.16 17.91,35.62 18.41,36.12 18.41,36.92 17.62,37.7 v17.62,41.36 | v12.09,19.19 13.47,17.82 R6.2
  Bottom 0.254: v8.02,33.5 8.73,32.78 11.51,32.78 11.99,32.3 11.99,19.3 v12.09,19.19 | JP1.1 17.62,41.75 v17.62,41.36
MOSI  (via drill 0.31)
  Top 0.254: R3.2 1.67,26.27 1.51,26.43 1.51,40.01 v2.7,41.2 | v17.57,36.43 17.56,36.42 AVR.15
  Bottom 0.254: JP1.4 12.06,46.67 11.43,46.04 8.89,46.04 8.34,45.48 8.34,44.29 9.08,43.55 | v2.7,41.2 4.05,42.55 8.08,42.55 9.08,43.55 | 9.08,43.55 14.45,38.18 16.59,38.18 17.57,37.2 v17.57,36.43
N$1
  Bottom 0.5: OPA.2 42.74,9.97 43.17,9.54 43.17,7.52 R17.1 R19.2
N$2  (via drill 0.31)
  Top 0.254: LED3.C 34.34,17.11 v34.34,17.62
  Bottom 0.254: v34.34,17.62 35.55,16.41 R12.1
N$5
  Bottom 0.5: OPA.7 44.51,9.97 43.86,10.63 L2.2 42.35,14.87 C4.1
N$6  (via drill 0.31)
  Top 0.254: R31.1 30.25,38.88 31.82,40.45 36.03,40.45 36.48,40.01 v37.15,40.01
  Bottom 0.254: LM324.2 34.77,40.74 37.15,40.74 | 37.15,40.74 R35.2 | v37.15,40.01 37.15,40.74
N$7  (via drill 0.31)
  Top 0.254: v36.32,42.8 37.55,42.8 D1.A | TPS1.TP 42.8,43.17 v42.51,42.88
  Bottom 0.254: LM324.1 35.43,41.91 v36.32,42.8 36.58,42.55 40.54,42.55 R35.1 42.07,42.44 v42.51,42.88
N$8  (via drill 0.31)
  Top 0.254: v37.78,38.73 39.79,40.74 R30.1 41.16,39.59 R29.2
  Bottom 0.254: LM324.3 36.2,39.37 36.83,38.73 v37.78,38.73
N$11  (via drill 0.31)
  Top 0.254: D1.C 41.44,42.88 43.38,40.95 43.38,39.05 v42.39,38.06 42.72,38.39 | v42.6,36.03 42.6,35.74 42.09,35.24 | 42.09,35.24 R26.1 | C16.+ 42.73,34.61 42.09,35.24 | v37.04,35.35 36.77,35.62 TPS2.TP
  Bottom 0.254: LM324.6 36.83,35.56 v37.04,35.35 37.78,34.61 C16.+ | v42.39,38.06 42.39,36.24 v42.6,36.03
N$12  (via drill 0.31)
  Top 0.254: R24.1 46.67,40.83 v46.35,41.15
  Bottom 0.254: LM324.5 40.11,36.83 R28.1 43.5,40.44 44.45,41.4 45.4,41.4 45.65,41.15 v46.35,41.15
N$14
  Top 0.254: R24.2 46.57,38.1 43.81,38.1 43.28,37.57 R25.2 41.24,37.15 R27.2
N$15  (via drill 0.31)
  Top 0.254: IRF.4 29.44,6.72 v29.8,6.36
  Bottom 0.254: v29.8,6.36 31.48,6.36 R14.1
N$16  (via drill 0.31)
  Top 0.254: R10.1 29.69,13.4 30.38,13.4 | 30.38,13.4 PWR-Q2.3 34.23,13.4 TPPWR.TP | v30.38,12.38 30.38,13.4
  Bottom 0.254: 28.3,12.69 PWR-Q1.1 29.04,12.38 v30.38,12.38
N$22
  Bottom 0.254: R23.1 43.92,28.26 R22.2 44.23,29.97 S1.3
N$23
  Bottom 0.254: R21.1 44.93,19.15 S2.4 47.69,19.24 R20.2
N$24
  Top 0.254: LED2.C 4.05,14.18 R18.2
N$25  (via drill 0.31)
  Top 0.254: LED1.C 36.14,14.94 v35.04,14.94
  Bottom 0.254: v35.04,14.94 35.33,14.65 R11.2
N$27
  Bottom 0.5: C5.2 39.06,11.14 | 39.06,11.14 R16.2 | OPA.3 39.16,11.24 39.06,11.14
N$31
  Top 0.254: DIS1.6 30.08,19.92 28.98,18.82 27.2,18.82 26.1,19.92 DIS2.6 24.69,20.31 19.52,20.31 17.95,18.74 15.46,18.74 | DIS3.6 15.46,19.14 15.46,18.74 | 15.46,18.74 R6.1
N$33
  Top 0.254: 34.64,11.34 IRF.8 36.18,12.8 LED1.A
  Top 1.5: IRF.8 IRF.7 IRF.6 IRF.5 34.55,7.37 J1.4 J1.3
N$34
  Top 0.254: DIS1.2 26.75,27.54 25.57,28.73 24.6,28.73 24.27,28.4 18.87,28.4 18.02,27.54 DIS2.2 16.59,27.54 15.24,28.89 14.02,28.89 13.32,28.19 7.71,28.19 DIS3.2 5.14,27.54 R2.1
N$35
  Top 0.254: DIS3.1 12.94,30.08 14.29,31.43 15.93,31.43 | DIS1.1 26.75,30.08 25.4,31.43 24.58,31.43 23.2,30.05 17.49,30.05 DIS2.1 16.11,31.43 15.93,31.43 | R7.1 15.88,31.49 15.93,31.43
N$36
  Top 0.254: DIS1.4 26.55,23.77 24.72,23.77 24.13,23.18 19.05,23.18 18.33,22.46 DIS2.4 16.11,23.81 13.97,23.81 12.62,22.46 DIS3.4 R4.1
N$37
  Top 0.254: DIS1.5 27.41,19.92 26.06,21.27 19.31,21.27 17.96,19.92 DIS2.5 16.19,19.92 14.84,21.27 14.13,21.27 13.49,20.64 7.78,20.64 DIS3.5 5.9,21.08 R5.1
N$38  (via drill 0.31)
  Top 0.254: DIS1.7 30.08,22.46 28.89,21.27 27.35,21.27 26.16,22.46 DIS2.7 19.41,22.46 18.22,21.27 15.87,21.27 DIS3.7 13.78,22.46 12.68,21.35 v9.37,21.35
  Bottom 0.254: v9.37,21.35 6.75,21.35 4.63,19.23 R8.1
N$39
  Top 0.254: DIS1.9 29.76,27.54 28.57,26.35 26.27,26.35 DIS2.9 19.29,27.54 18.1,26.35 15.87,26.35 DIS3.9 8.69,27.54 7.43,26.27 R3.1
N$40
  Top 0.254: DIS1.10 29.76,30.08 28.57,28.89 26.7,28.89 25.52,30.08 DIS2.10 24.3,29.3 18.51,29.3 18.1,28.89 16.83,28.89 15.64,30.08 DIS3.10 13.97,30.08 12.74,28.85 6.39,28.85 5.95,29.29 R1.1
OPA_OUT  (via drill 0.31)
  Top 0.5: R33.1 23.11,31.48 v23.11,30.87 | v29.88,20.89 30.25,21.26 40.08,21.26 43.79,17.54 47.96,17.54 48.5,17 48.5,14.49 v48.17,14.16
  Bottom 0.5: 44.62,7.38 R17.2 47.65,7.32 48.17,7.84 48.17,11.23 | v23.11,30.87 23.77,30.21 23.77,29.1 24.06,28.81 29.43,28.81 30.46,27.78 30.46,21.46 v29.88,20.89 30.67,20.1 TPTEMP.TP | v48.17,14.16 48.17,11.23 | OPA.6 46.55,11.23 48.17,11.23
P-FET_GATE
  Bottom 0.254: R15.1 | PWR-Q1.3 32.63,13.64 33.39,12.88 33.39,10.73 32.76,10.1 R15.1 | R15.1 32.01,8.59 R14.2
PC2  (via drill 0.31)
  Top 0.254: 25.38,35.62 AVR.25 26.21,35.62 26.79,36.2 | 26.79,36.2 26.79,38.59 30.01,41.81 34.22,41.81 v36.41,44 | 26.79,36.2 v27.57,36.2 | v27.65,34.88 27.71,34.82 R32.2
  Bottom 0.254: v36.41,44 36.41,47.3 37.19,48.09 39.75,48.09 40.32,47.51 J2.2 | v27.57,36.2 27.65,36.12 v27.65,34.88
PC3
  Top 0.254: AVR.26 25.98,36.42 26.33,36.78 26.33,38.84 29.8,42.31 33.85,42.31 36.41,44.87 36.41,45.48 36.96,46.04 J2.1
RST  (via drill 0.31)
  Top 0.254: JP1.5 8.83,44.08 R34.2 | AVR.29 22.99,38.82 v21.77,38.82
  Bottom 0.254: JP1.5 9.53,44.22 14.92,38.82 v21.77,38.82
RX
  Top 0.254: AVR.30 26.28,39.62 29.53,42.86 31.75,42.86 32.07,43.18 UART.2
SAFETY  (via drill 0.31)
  Top 0.254: v32.57,18.86 33.17,18.25 | 33.17,18.25 R9.2 33.17,15.68 PWR-Q2.1 | 33.17,18.25 35.12,18.25 35.7,17.67 37.06,17.67 | R32.1 30.02,32.81 v30.96,32.81 | 37.06,17.67 TPS3.TP | LED3.A 37.06,16.53 37.06,17.67
  Bottom 0.254: 43.71,38.73 R28.2 44.03,39.05 45.09,39.05 47.71,36.42 47.71,33.93 46.81,33.02 44.45,33.02 43.66,33.81 41.27,33.81 40.48,33.02 36.83,33.02 35.56,34.29 LM324.7 34.67,34.03 32.59,31.96 | v30.96,32.81 31.74,32.81 32.59,31.96 | 32.59,31.96 32.59,27.5 33.64,26.46 33.64,23.28 32.57,22.21 v32.57,18.86
SCK  (via drill 0.31)
  Top 0.254: AVR.17 17.82,34.11 R7.2 14.74,34.11 12.94,32.31 11.05,32.31 9.38,30.64 8.49,30.64 7.86,31.27 5.71,31.27 5,31.99 v5,34.13 | v8.44,41.27 10.32,41.27 12.06,43.02 JP1.3
  Bottom 0.254: v5,34.13 5,37.84 v8.44,41.27
SCL  (via drill 0.31)
  Top 0.254: AVR.28 21.67,38.02 20,39.69 v20,40.36
  Bottom 0.254: v20,40.36 20,40.56 21.67,42.23 22.86,42.23 23.81,43.18 I2C.2
SDA  (via drill 0.31)
  Top 0.254: AVR.27 21.52,37.22 19.05,39.69 v19.05,40.37
  Bottom 0.254: v19.05,40.37 19.05,42.53 21.26,44.74 | 21.26,44.74 21.27,44.76 | 21.26,44.74 21.27,44.74 I2C.1
SENSOR0
  Bottom 0.5: R16.1 38.63,8.48 38.63,5.37 39.63,4.37 J1.2
THERMO0
  Top 0.254: 26.04,34.85 24.14,34.85 23.73,35.25 22.79,35.25 22.64,35.1 AVR.23 | R33.2 22.64,32.7 | C10.1 26.04,33.98 26.04,34.85 | R31.2 28.68,35.5 26.99,35.5 26.34,34.85 26.04,34.85
  Top 0.5: 22.64,32.7 AVR.23
TX
  Top 0.254: AVR.31 26.13,40.42 29.53,43.81 UART.1
VCC  (via drill 0.31, 0.4)
  Top 0.254: v19.04,44.46 16.19,47.31 JP1.2 13.34,46.04 7.8,46.04 R34.1 | v47.31,31.43 47.31,31.59 | 19.15,12.26 C2.2 | LED2.A C13.+
  Top 0.5: v21.27,40.96 21.04,41.19 AVR.4 21.04,43.68 20.66,44.06 19.44,44.06 | C2.2 18.88,12.04 v17.56,13.35 17.12,13.79 LDO.2 13.73,13.79 11.2,16.33 C13.+ | 47.31,31.59 46.83,32.07 40.8,32.07 39.76,33.11 | 39.76,33.11 38.58,34.29 38.58,37.2 38.51,37.27 | v18.57,38.02 18.26,38.34 18.26,41 18.61,41.36 18.9,41.36 19.44,41.89 AVR.6 19.44,44.06 | v19.15,11.23 19.15,12.26 | 39.76,33.11 38.92,32.28 31.91,32.28 31.29,31.66 v29.72,31.66 | J1.1 42.17,4.53 42.76,5.12 42.76,9.31 45.88,12.43 C6.2 46.01,15.4 v47.67,15.4 | v19.04,44.46 19.44,44.06 | v32.07,38.1 32.48,38.51 34.55,38.51 35.21,37.85 C9.1 35.33,37.27 38.51,37.27 | 38.51,37.27 39.25,37.27 R27.1 R29.1
  Bottom 0.254: R22.1 47.91,26.6 R20.1 | L2.1 46.78,15.4
  Bottom 0.5: v32.07,38.1 LM324.4 | v21.27,40.96 24.13,40.96 26.42,38.67 26.42,33.14 27.9,31.66 v29.72,31.66 | R22.1 45.94,29.27 47.31,30.64 v47.31,31.43 | v18.57,38.02 18.57,35.72 17.94,35.08 17.22,35.08 16.06,33.91 16.06,29.35 16.76,28.64 L1.2 19.85,28.5 19.85,15.64 v17.56,13.35 | J1.1 42.17,2.26 40.78,0.87 23.24,0.87 20.27,3.84 20.27,10.11 v19.15,11.23 | 46.78,15.4 v47.67,15.4 | C12.1 19.17,44.6 v19.04,44.46

### Text on the board
tNames: DA-CL-G | TX-RX-G | C3-C2-G | 30.04.2015 / v1.2
bNames: 1